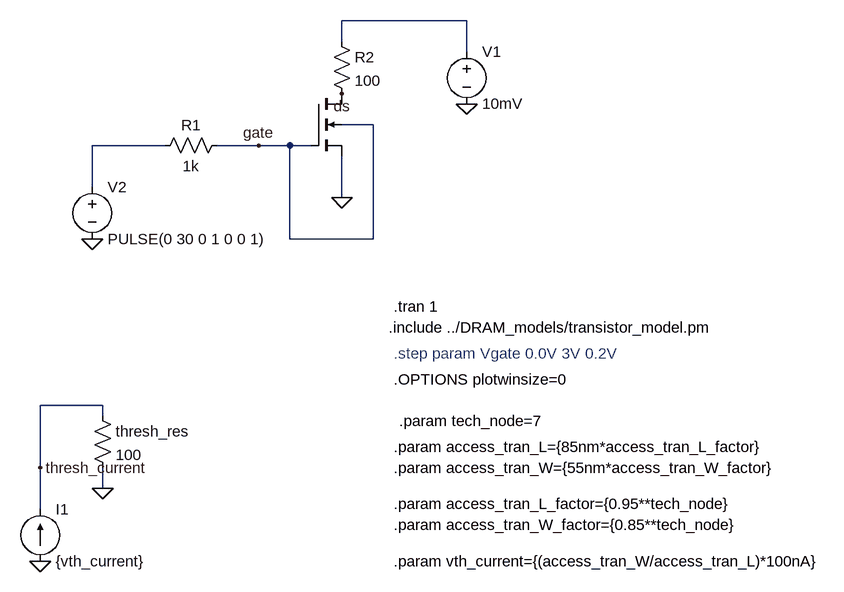
[diagram p0: schematic transistor_vth.asc]
transistor_vth.asc, the LTspice schematic file:
Version 4
SHEET 1 4232 2520
WIRE -2240 -736 -2432 -736
WIRE -2432 -704 -2432 -736
WIRE -2240 -688 -2240 -736
WIRE -2384 -576 -2432 -576
WIRE -2704 -544 -2816 -544
WIRE -2560 -544 -2624 -544
WIRE -2512 -544 -2560 -544
WIRE -2480 -544 -2512 -544
WIRE -2816 -480 -2816 -544
WIRE -2432 -464 -2432 -528
WIRE -2512 -400 -2512 -544
WIRE -2384 -400 -2384 -576
WIRE -2384 -400 -2512 -400
WIRE -2800 -144 -2896 -144
WIRE -2800 -128 -2800 -144
WIRE -2896 -48 -2896 -144
WIRE -2800 -16 -2800 -48
WIRE -2896 16 -2896 -48
FLAG -2240 -608 0
FLAG -2432 -464 0
FLAG -2816 -400 0
FLAG -2432 -624 ds
FLAG -2560 -544 gate
FLAG -2896 96 0
FLAG -2800 -16 0
FLAG -2896 -48 thresh_current
SYMBOL nmos4 -2480 -624 R0
WINDOW 0 104 24 Invisible 2
WINDOW 3 179 41 Invisible 2
SYMATTR InstName M19
SYMATTR Value pmos
SYMATTR Value2 l=access_tran_L w=access_tran_W
SYMBOL res -2720 -528 R270
WINDOW 0 32 56 VTop 2
WINDOW 3 0 56 VBottom 2
SYMATTR InstName R1
SYMATTR Value 1k
SYMBOL res -2448 -720 R0
SYMATTR InstName R2
SYMATTR Value 100
SYMBOL voltage -2240 -704 R0
WINDOW 123 0 0 Left 2
WINDOW 39 0 0 Left 2
SYMATTR InstName V1
SYMATTR Value 10mV
SYMBOL voltage -2816 -496 R0
WINDOW 123 0 0 Left 2
WINDOW 39 0 0 Left 2
SYMATTR InstName V2
SYMATTR Value PULSE(0 30 0 1 0 0 1)
SYMBOL current -2896 96 M180
WINDOW 0 24 80 Left 2
WINDOW 3 24 0 Left 2
WINDOW 123 0 0 Left 2
WINDOW 39 0 0 Left 2
SYMATTR InstName I1
SYMATTR Value {vth_current}
SYMBOL res -2816 -144 R0
SYMATTR InstName thresh_res
SYMATTR Value 100
TEXT -2360 -264 Left 2 !.include ../DRAM_models/transistor_model.pm
TEXT -2352 -296 Left 2 !.tran 1
TEXT -2352 -224 Left 2 ;.step param Vgate 0.0V 3V 0.2V
TEXT -2352 -80 Left 2 !.param access_tran_L={85nm*access_tran_L_factor}
TEXT -2352 -48 Left 2 !.param access_tran_W={55nm*access_tran_W_factor}
TEXT -2352 8 Left 2 !.param access_tran_L_factor={0.95**tech_node}
TEXT -2352 40 Left 2 !.param access_tran_W_factor={0.85**tech_node}
TEXT -2344 -120 Left 2 !.param tech_node=7
TEXT -2352 96 Left 2 !.param vth_current={(access_tran_W/access_tran_L)*100nA}
TEXT -2352 -184 Left 2 !.OPTIONS plotwinsize=0

The netlist it stands for:
* transistor_vth.asc
M19 ds gate 0 gate pmos l=access_tran_L w=access_tran_W
R1 N002 gate 1k
R2 N001 ds 100
V1 N001 0 10mV
V2 N002 0 PULSE(0 30 0 1 0 0 1)
I1 0 thresh_current {vth_current}
R§thresh_res thresh_current 0 100
.model NMOS NMOS
.model PMOS PMOS
.lib standard.mos
.include ../DRAM_models/transistor_model.pm
.tran 1
* .step param Vgate 0.0V 3V 0.2V
.param access_tran_L={85nm*access_tran_L_factor}
.param access_tran_W={55nm*access_tran_W_factor}
.param access_tran_L_factor={0.95**tech_node}
.param access_tran_W_factor={0.85**tech_node}
.param tech_node=7
.param vth_current={(access_tran_W/access_tran_L)*100nA}
.OPTIONS plotwinsize=0
.backanno
.end